# EAGLE design line-sensor-r2-linear (EAGLE 9.3.1)
Assembly variants: I2C, USART, SPI

## Sheet 1 of 4
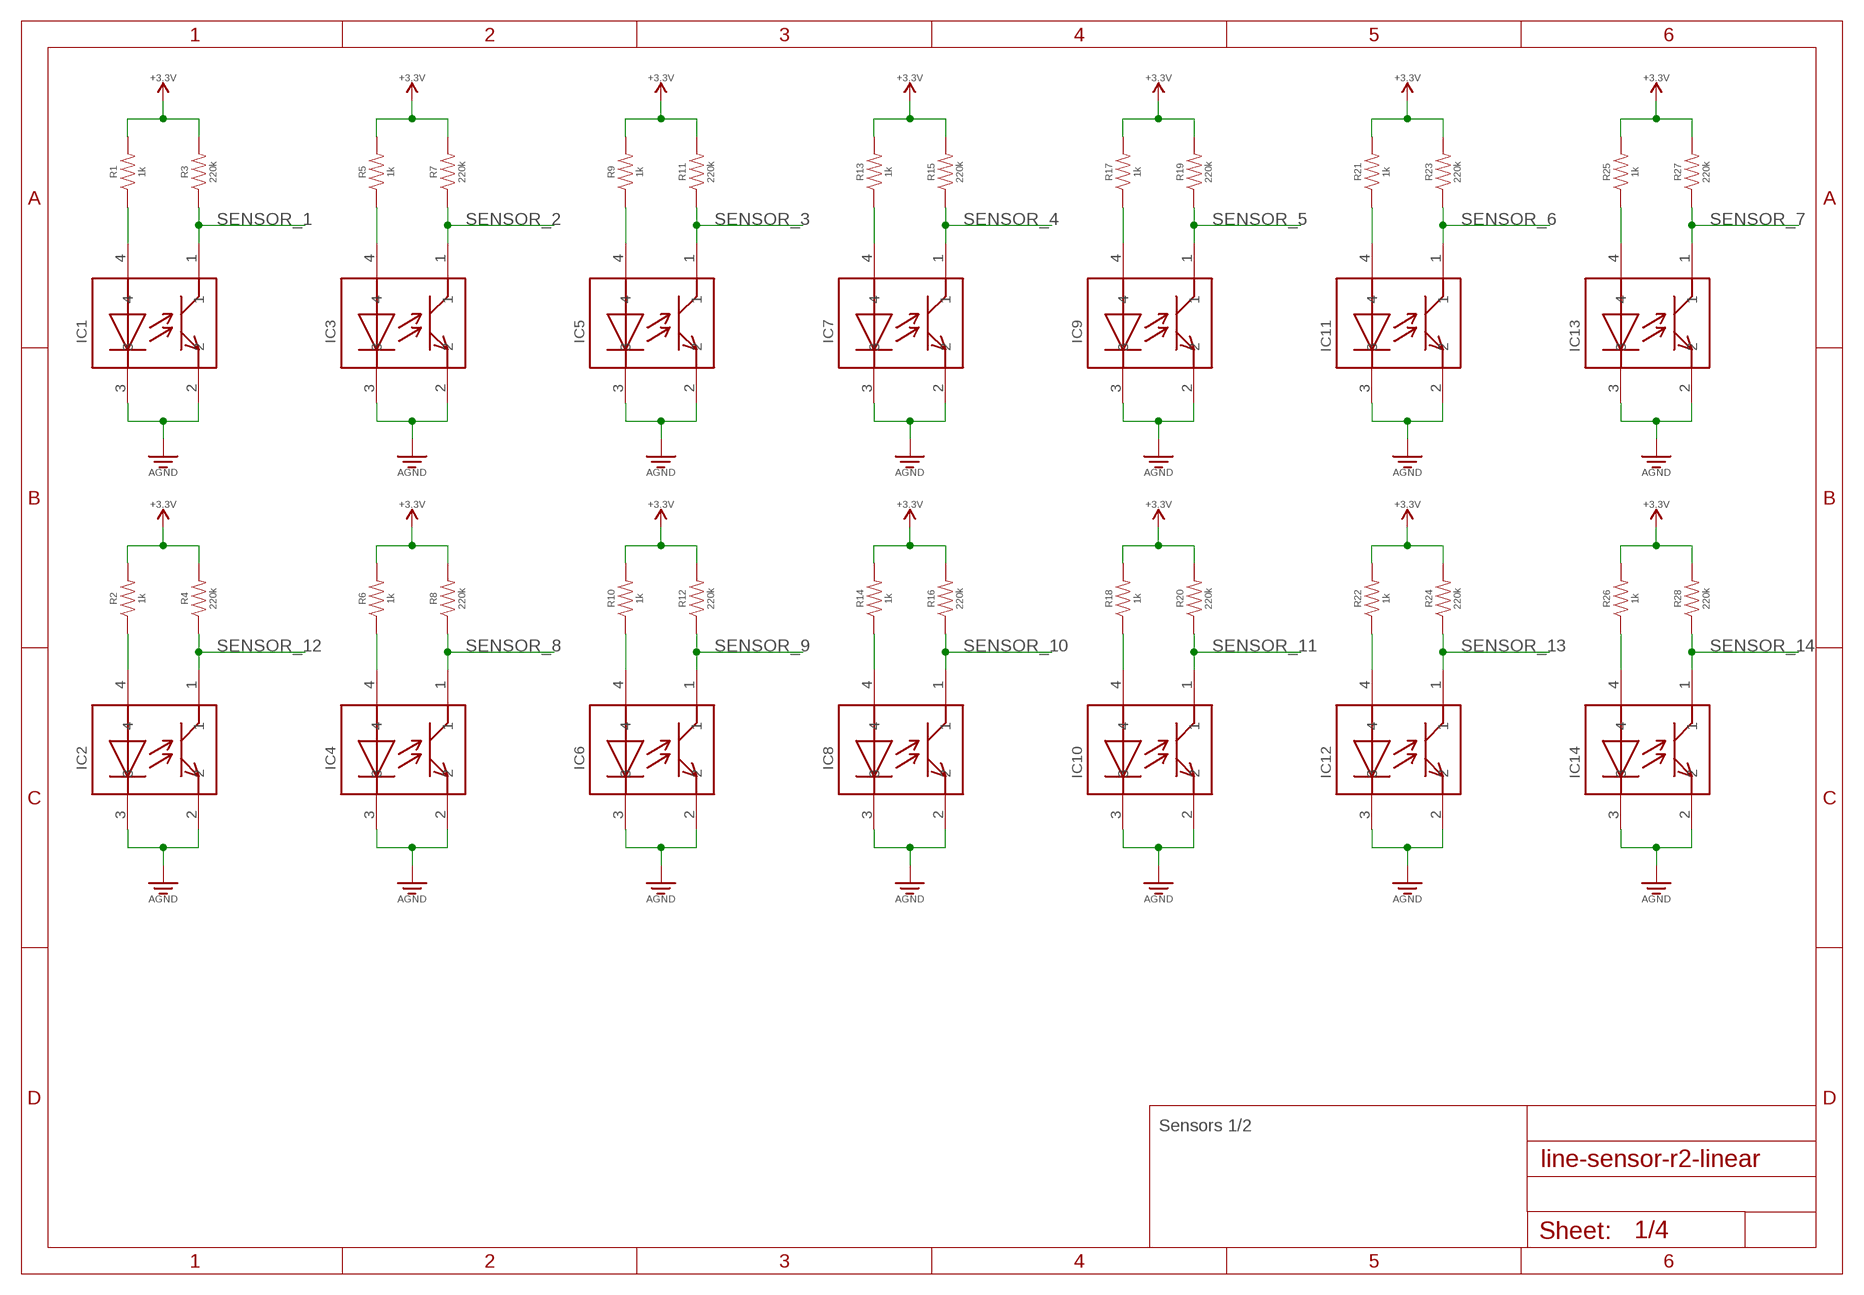
[diagram p0: schematic, sheet 1]

### Parts
IC1  GP2S60  [GP2S60]
IC2  GP2S60  [GP2S60]
IC3  GP2S60  [GP2S60]
IC4  GP2S60  [GP2S60]
IC5  GP2S60  [GP2S60]
IC6  GP2S60  [GP2S60]
IC7  GP2S60  [GP2S60]
IC8  GP2S60  [GP2S60]
IC9  GP2S60  [GP2S60]
IC10  GP2S60  [GP2S60]
IC11  GP2S60  [GP2S60]
IC12  GP2S60  [GP2S60]
IC13  GP2S60  [GP2S60]
IC14  GP2S60  [GP2S60]
R1  1k  RESISTOR_0.1W  [RESISTOR-0603]
R2  1k  RESISTOR_0.1W  [RESISTOR-0603]
R3  220k  RESISTOR_0.1W  [RESISTOR-0603]
R4  220k  RESISTOR_0.1W  [RESISTOR-0603]
R5  1k  RESISTOR_0.1W  [RESISTOR-0603]
R6  1k  RESISTOR_0.1W  [RESISTOR-0603]
R7  220k  RESISTOR_0.1W  [RESISTOR-0603]
R8  220k  RESISTOR_0.1W  [RESISTOR-0603]
R9  1k  RESISTOR_0.1W  [RESISTOR-0603]
R10  1k  RESISTOR_0.1W  [RESISTOR-0603]
R11  220k  RESISTOR_0.1W  [RESISTOR-0603]
R12  220k  RESISTOR_0.1W  [RESISTOR-0603]
R13  1k  RESISTOR_0.1W  [RESISTOR-0603]
R14  1k  RESISTOR_0.1W  [RESISTOR-0603]
R15  220k  RESISTOR_0.1W  [RESISTOR-0603]
R16  220k  RESISTOR_0.1W  [RESISTOR-0603]
R17  1k  RESISTOR_0.1W  [RESISTOR-0603]
R18  1k  RESISTOR_0.1W  [RESISTOR-0603]
R19  220k  RESISTOR_0.1W  [RESISTOR-0603]
R20  220k  RESISTOR_0.1W  [RESISTOR-0603]
R21  1k  RESISTOR_0.1W  [RESISTOR-0603]
R22  1k  RESISTOR_0.1W  [RESISTOR-0603]
R23  220k  RESISTOR_0.1W  [RESISTOR-0603]
R24  220k  RESISTOR_0.1W  [RESISTOR-0603]
R25  1k  RESISTOR_0.1W  [RESISTOR-0603]
R26  1k  RESISTOR_0.1W  [RESISTOR-0603]
R27  220k  RESISTOR_0.1W  [RESISTOR-0603]
R28  220k  RESISTOR_0.1W  [RESISTOR-0603]
SUPPLY1  +3.3V  (no package)
SUPPLY2  +3.3V  (no package)
SUPPLY3  +3.3V  (no package)
SUPPLY4  +3.3V  (no package)
SUPPLY5  +3.3V  (no package)
SUPPLY6  +3.3V  (no package)
SUPPLY7  +3.3V  (no package)
SUPPLY8  +3.3V  (no package)
SUPPLY9  +3.3V  (no package)
SUPPLY10  +3.3V  (no package)
SUPPLY11  +3.3V  (no package)
SUPPLY12  +3.3V  (no package)
SUPPLY13  +3.3V  (no package)
SUPPLY14  +3.3V  (no package)

### Nets
GND: IC1.2 IC1.3 IC2.2 IC2.3 IC3.2 IC3.3 IC4.2 IC4.3 IC5.2 IC5.3 IC6.2 IC6.3 IC7.2 IC7.3 IC8.2 IC8.3 IC9.2 IC9.3 IC10.2 IC10.3 IC11.2 IC11.3 IC12.2 IC12.3 IC13.2 IC13.3 IC14.2 IC14.3 ; supply symbol labelled AGND ; also sheet 2,3,4
N$1: IC3.4 R5.P$1
N$2: IC1.4 R1.P$1
N$3: IC5.4 R9.P$1
N$4: IC7.4 R13.P$1
N$5: IC9.4 R17.P$1
N$6: IC11.4 R21.P$1
N$7: IC13.4 R25.P$1
N$8: IC4.4 R6.P$1
N$9: IC6.4 R10.P$1
N$10: IC8.4 R14.P$1
N$11: IC10.4 R18.P$1
N$12: IC2.4 R2.P$1
N$13: IC12.4 R22.P$1
N$14: IC14.4 R26.P$1
SENSOR_1: IC1.1 R3.P$1 ; also sheet 3
SENSOR_2: IC3.1 R7.P$1 ; also sheet 3
SENSOR_3: IC5.1 R11.P$1 ; also sheet 3
SENSOR_4: IC7.1 R15.P$1 ; also sheet 3
SENSOR_5: IC9.1 R19.P$1 ; also sheet 3
SENSOR_6: IC11.1 R23.P$1 ; also sheet 3
SENSOR_7: IC13.1 R27.P$1 ; also sheet 3
SENSOR_8: IC4.1 R8.P$1 ; also sheet 3
SENSOR_9: IC6.1 R12.P$1 ; also sheet 3
SENSOR_10: IC8.1 R16.P$1 ; also sheet 3
SENSOR_11: IC10.1 R20.P$1 ; also sheet 3
SENSOR_12: IC2.1 R4.P$1 ; also sheet 3
SENSOR_13: IC12.1 R24.P$1 ; also sheet 3
SENSOR_14: IC14.1 R28.P$1 ; also sheet 3
VDDA: R1.P$2 R2.P$2 R3.P$2 R4.P$2 R5.P$2 R6.P$2 R7.P$2 R8.P$2 R9.P$2 R10.P$2 R11.P$2 R12.P$2 R13.P$2 R14.P$2 R15.P$2 R16.P$2 R17.P$2 R18.P$2 R19.P$2 R20.P$2 R21.P$2 R22.P$2 R23.P$2 R24.P$2 R25.P$2 R26.P$2 R27.P$2 R28.P$2 SUPPLY1.VCC SUPPLY2.VCC SUPPLY3.VCC SUPPLY4.VCC SUPPLY5.VCC SUPPLY6.VCC SUPPLY7.VCC SUPPLY8.VCC SUPPLY9.VCC SUPPLY10.VCC SUPPLY11.VCC SUPPLY12.VCC SUPPLY13.VCC SUPPLY14.VCC ; also sheet 2,3,4

### Notes on the sheet
- Sensors 1/2

## Sheet 2 of 4
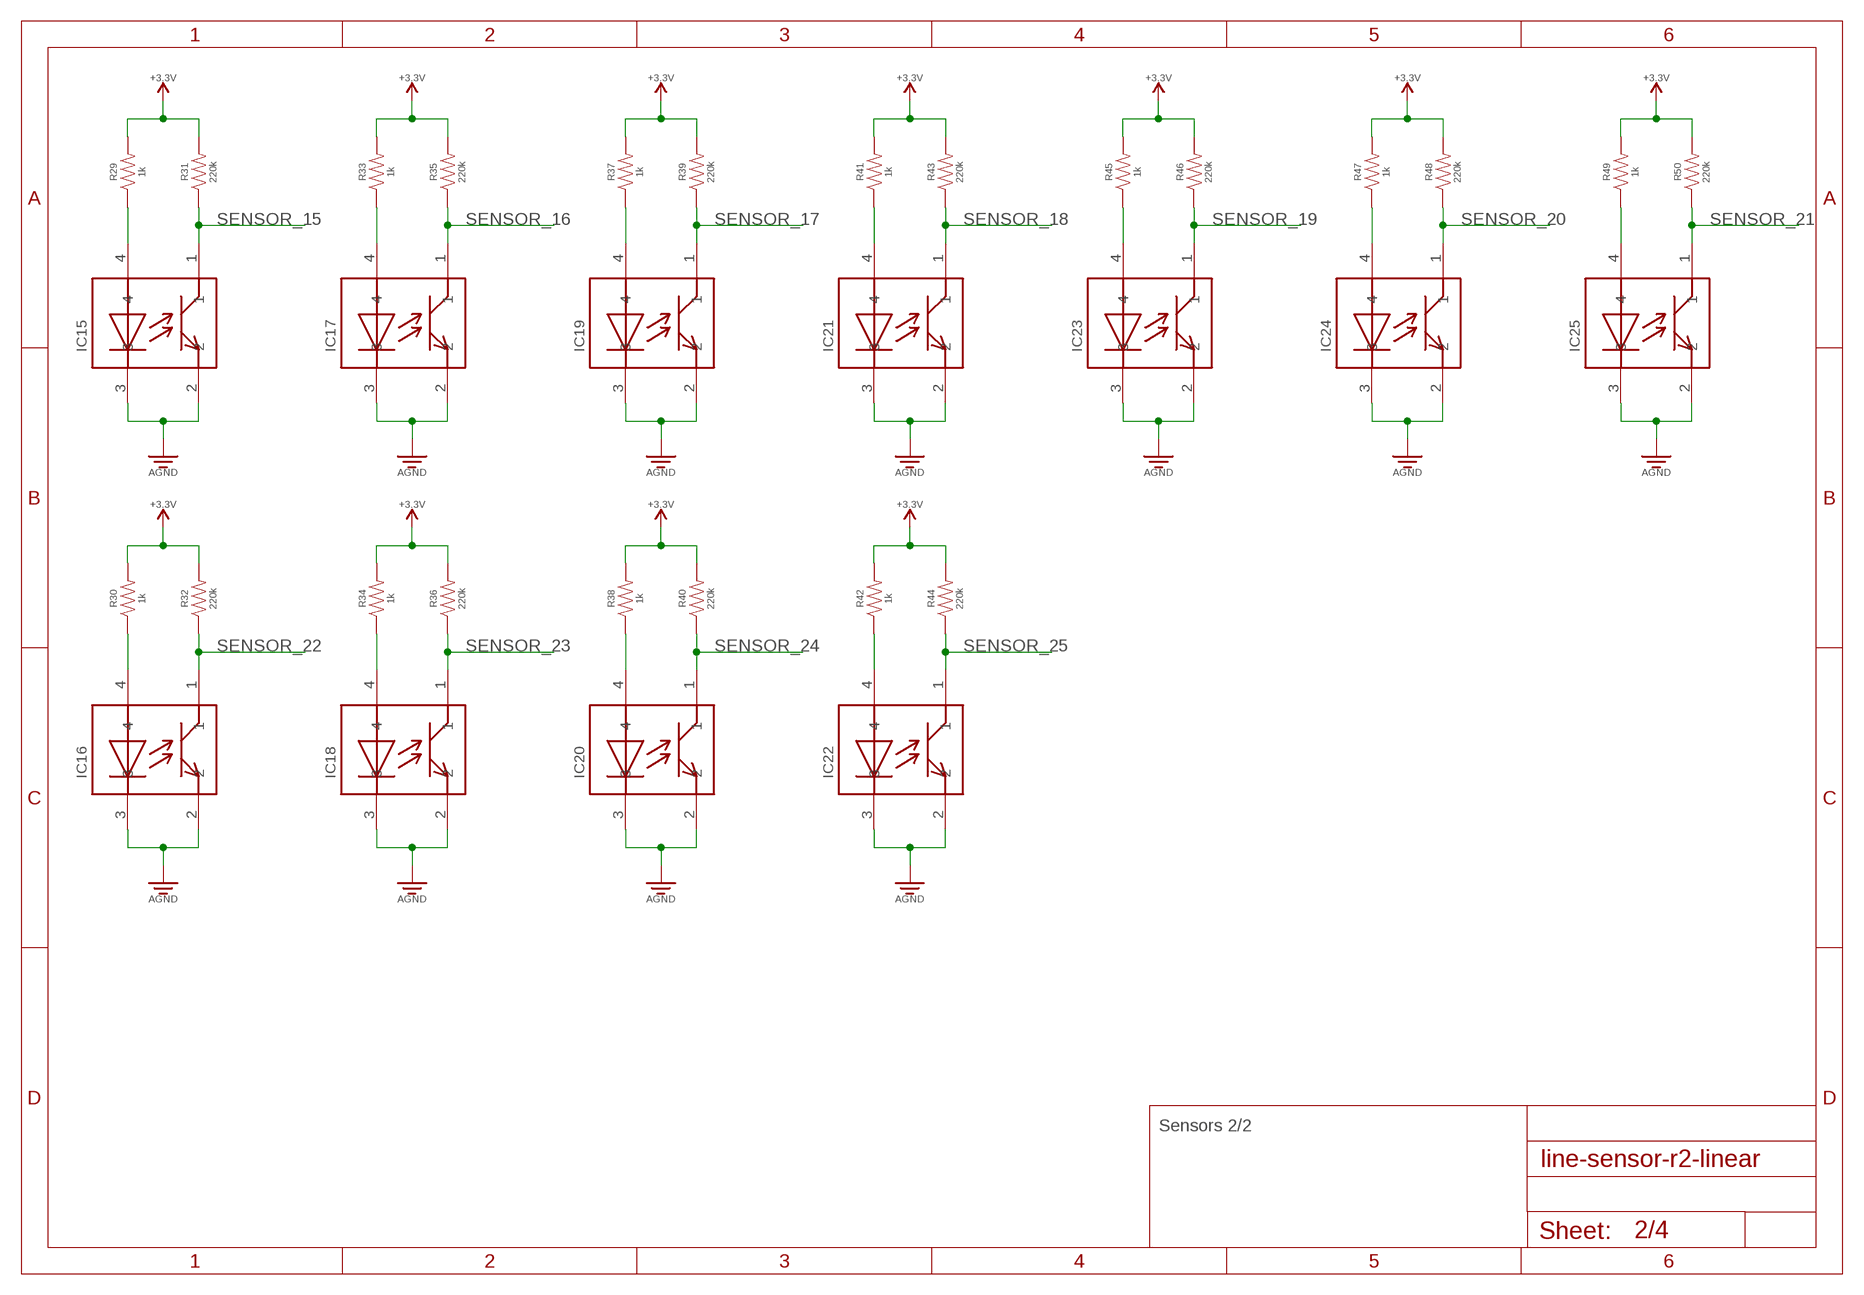
[diagram p1: schematic, sheet 2]

### Parts
IC15  GP2S60  [GP2S60]
IC16  GP2S60  [GP2S60]
IC17  GP2S60  [GP2S60]
IC18  GP2S60  [GP2S60]
IC19  GP2S60  [GP2S60]
IC20  GP2S60  [GP2S60]
IC21  GP2S60  [GP2S60]
IC22  GP2S60  [GP2S60]
IC23  GP2S60  [GP2S60]
IC24  GP2S60  [GP2S60]
IC25  GP2S60  [GP2S60]
R29  1k  RESISTOR_0.1W  [RESISTOR-0603]
R30  1k  RESISTOR_0.1W  [RESISTOR-0603]
R31  220k  RESISTOR_0.1W  [RESISTOR-0603]
R32  220k  RESISTOR_0.1W  [RESISTOR-0603]
R33  1k  RESISTOR_0.1W  [RESISTOR-0603]
R34  1k  RESISTOR_0.1W  [RESISTOR-0603]
R35  220k  RESISTOR_0.1W  [RESISTOR-0603]
R36  220k  RESISTOR_0.1W  [RESISTOR-0603]
R37  1k  RESISTOR_0.1W  [RESISTOR-0603]
R38  1k  RESISTOR_0.1W  [RESISTOR-0603]
R39  220k  RESISTOR_0.1W  [RESISTOR-0603]
R40  220k  RESISTOR_0.1W  [RESISTOR-0603]
R41  1k  RESISTOR_0.1W  [RESISTOR-0603]
R42  1k  RESISTOR_0.1W  [RESISTOR-0603]
R43  220k  RESISTOR_0.1W  [RESISTOR-0603]
R44  220k  RESISTOR_0.1W  [RESISTOR-0603]
R45  1k  RESISTOR_0.1W  [RESISTOR-0603]
R46  220k  RESISTOR_0.1W  [RESISTOR-0603]
R47  1k  RESISTOR_0.1W  [RESISTOR-0603]
R48  220k  RESISTOR_0.1W  [RESISTOR-0603]
R49  1k  RESISTOR_0.1W  [RESISTOR-0603]
R50  220k  RESISTOR_0.1W  [RESISTOR-0603]
SUPPLY15  +3.3V  (no package)
SUPPLY16  +3.3V  (no package)
SUPPLY17  +3.3V  (no package)
SUPPLY18  +3.3V  (no package)
SUPPLY19  +3.3V  (no package)
SUPPLY20  +3.3V  (no package)
SUPPLY21  +3.3V  (no package)
SUPPLY22  +3.3V  (no package)
SUPPLY23  +3.3V  (no package)
SUPPLY24  +3.3V  (no package)
SUPPLY25  +3.3V  (no package)

### Nets
GND: IC15.2 IC15.3 IC16.2 IC16.3 IC17.2 IC17.3 IC18.2 IC18.3 IC19.2 IC19.3 IC20.2 IC20.3 IC21.2 IC21.3 IC22.2 IC22.3 IC23.2 IC23.3 IC24.2 IC24.3 IC25.2 IC25.3 ; supply symbol labelled AGND ; also sheet 1,3,4
N$15: IC15.4 R29.P$1
N$16: IC17.4 R33.P$1
N$17: IC19.4 R37.P$1
N$18: IC21.4 R41.P$1
N$19: IC23.4 R45.P$1
N$20: IC24.4 R47.P$1
N$21: IC25.4 R49.P$1
N$22: IC16.4 R30.P$1
N$23: IC18.4 R34.P$1
N$24: IC20.4 R38.P$1
N$25: IC22.4 R42.P$1
SENSOR_15: IC15.1 R31.P$1 ; also sheet 3
SENSOR_16: IC17.1 R35.P$1 ; also sheet 3
SENSOR_17: IC19.1 R39.P$1 ; also sheet 3
SENSOR_18: IC21.1 R43.P$1 ; also sheet 3
SENSOR_19: IC23.1 R46.P$1 ; also sheet 3
SENSOR_20: IC24.1 R48.P$1 ; also sheet 3
SENSOR_21: IC25.1 R50.P$1 ; also sheet 3
SENSOR_22: IC16.1 R32.P$1 ; also sheet 3
SENSOR_23: IC18.1 R36.P$1 ; also sheet 3
SENSOR_24: IC20.1 R40.P$1 ; also sheet 3
SENSOR_25: IC22.1 R44.P$1 ; also sheet 3
VDDA: R29.P$2 R30.P$2 R31.P$2 R32.P$2 R33.P$2 R34.P$2 R35.P$2 R36.P$2 R37.P$2 R38.P$2 R39.P$2 R40.P$2 R41.P$2 R42.P$2 R43.P$2 R44.P$2 R45.P$2 R46.P$2 R47.P$2 R48.P$2 R49.P$2 R50.P$2 SUPPLY15.VCC SUPPLY16.VCC SUPPLY17.VCC SUPPLY18.VCC SUPPLY19.VCC SUPPLY20.VCC SUPPLY21.VCC SUPPLY22.VCC SUPPLY23.VCC SUPPLY24.VCC SUPPLY25.VCC ; also sheet 1,3,4

### Notes on the sheet
- Sensors 2/2

## Sheet 3 of 4
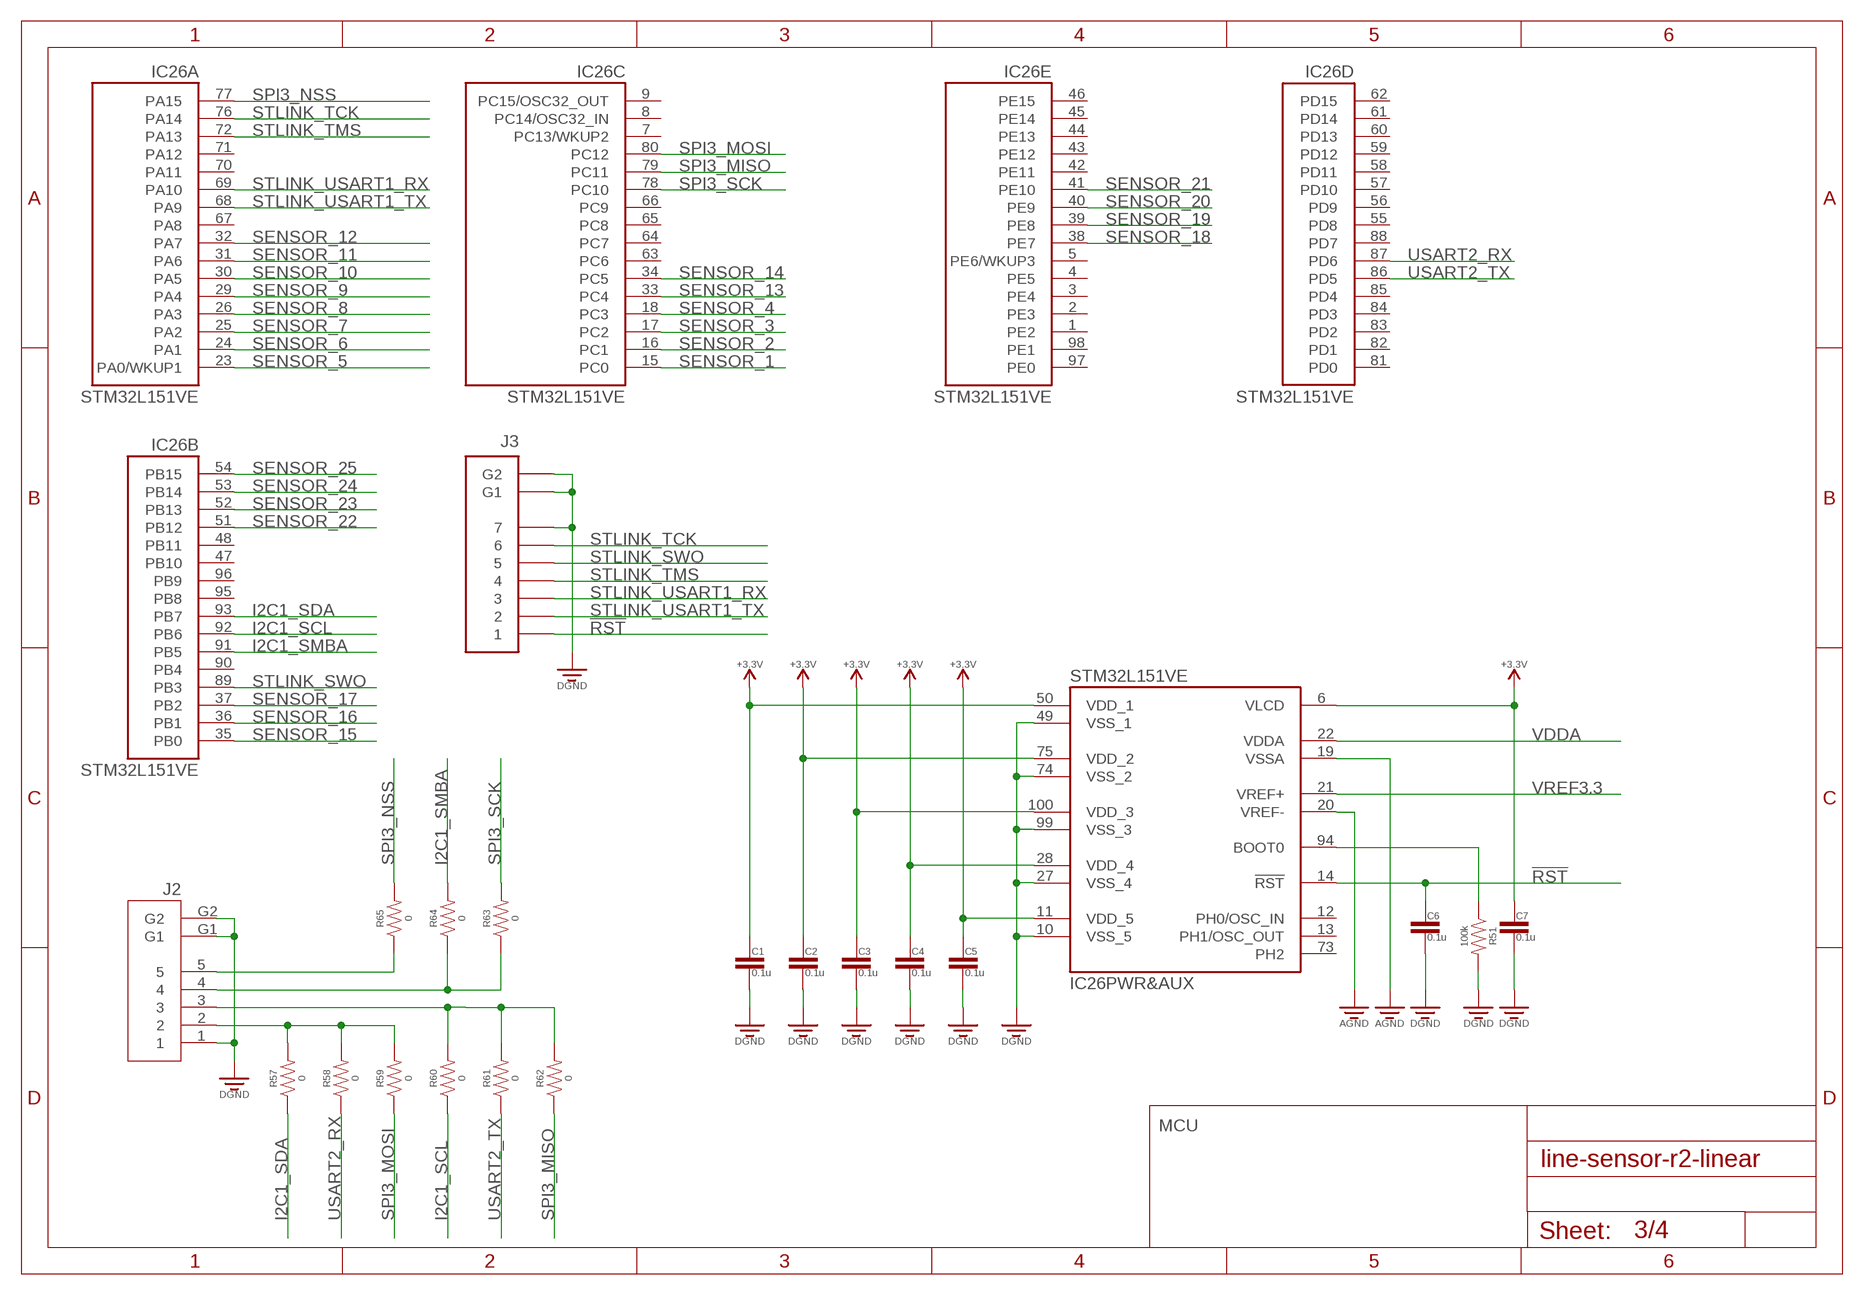
[diagram p2: schematic, sheet 3]

### Parts
C1  0.1u  CAPACITOR0603  [CAPACITOR-0603]
C2  0.1u  CAPACITOR0603  [CAPACITOR-0603]
C3  0.1u  CAPACITOR0603  [CAPACITOR-0603]
C4  0.1u  CAPACITOR0603  [CAPACITOR-0603]
C5  0.1u  CAPACITOR0603  [CAPACITOR-0603]
C6  0.1u  CAPACITOR0603  [CAPACITOR-0603]
C7  0.1u  CAPACITOR0603  [CAPACITOR-0603]
IC26  STM32L151VE  [LQFP100_14X14]
J2  MOLEX-502382-05XX  [MOLEX-502382-05XX]
J3  MOLEX-53261-0771  [MOLEX-53261-0771]
R51  100k  RESISTOR_0.1W  [RESISTOR-0603]
R57  0  RESISTOR_0.1W  [RESISTOR-0603]  (not fitted in variant USART)  (not fitted in variant SPI)
R58  0  RESISTOR_0.1W  [RESISTOR-0603]  (not fitted in variant I2C)  (not fitted in variant SPI)
R59  0  RESISTOR_0.1W  [RESISTOR-0603]  (not fitted in variant I2C)  (not fitted in variant USART)
R60  0  RESISTOR_0.1W  [RESISTOR-0603]  (not fitted in variant USART)  (not fitted in variant SPI)
R61  0  RESISTOR_0.1W  [RESISTOR-0603]  (not fitted in variant I2C)  (not fitted in variant SPI)
R62  0  RESISTOR_0.1W  [RESISTOR-0603]  (not fitted in variant I2C)  (not fitted in variant USART)
R63  0  RESISTOR_0.1W  [RESISTOR-0603]  (not fitted in variant I2C)  (not fitted in variant USART)
R64  0  RESISTOR_0.1W  [RESISTOR-0603]  (not fitted in variant USART)  (not fitted in variant SPI)
R65  0  RESISTOR_0.1W  [RESISTOR-0603]  (not fitted in variant I2C)  (not fitted in variant USART)
SUPPLY26  +3.3V  (no package)
SUPPLY27  +3.3V  (no package)
SUPPLY28  +3.3V  (no package)
SUPPLY29  +3.3V  (no package)
SUPPLY30  +3.3V  (no package)
SUPPLY31  +3.3V  (no package)

### Nets
!RST: C6.1 IC26.14(PWR&AUX:!RST!) J3.1
BOOT0: IC26.94(PWR&AUX:BOOT0) R51.P$1
GND: C1.2 C2.2 C3.2 C4.2 C5.2 C6.2 C7.2 IC26.10(PWR&AUX:VSS_5) IC26.19(PWR&AUX:VSSA) IC26.20(PWR&AUX:VREF-) IC26.27(PWR&AUX:VSS_4) IC26.49(PWR&AUX:VSS_1) IC26.74(PWR&AUX:VSS_2) IC26.99(PWR&AUX:VSS_3) J2.1 J2.G1 J2.G2 J3.7 J3.G1 J3.G2 R51.P$2 ; supply symbol labelled DGND, AGND ; also sheet 1,2,4
I2C1_SCL: IC26.92(B:PB6) R60.P$1
I2C1_SDA: IC26.93(B:PB7) R57.P$1
I2C1_SMBA: IC26.91(B:PB5) R64.P$2
N$26: J2.2 R57.P$2 R58.P$2 R59.P$2
N$27: J2.3 R60.P$2 R61.P$2 R62.P$2
N$28: J2.4 R63.P$1 R64.P$1
N$29: J2.5 R65.P$1
SENSOR_1: IC26.15(C:PC0) ; also sheet 1
SENSOR_2: IC26.16(C:PC1) ; also sheet 1
SENSOR_3: IC26.17(C:PC2) ; also sheet 1
SENSOR_4: IC26.18(C:PC3) ; also sheet 1
SENSOR_5: IC26.23(A:PA0/WKUP1) ; also sheet 1
SENSOR_6: IC26.24(A:PA1) ; also sheet 1
SENSOR_7: IC26.25(A:PA2) ; also sheet 1
SENSOR_8: IC26.26(A:PA3) ; also sheet 1
SENSOR_9: IC26.29(A:PA4) ; also sheet 1
SENSOR_10: IC26.30(A:PA5) ; also sheet 1
SENSOR_11: IC26.31(A:PA6) ; also sheet 1
SENSOR_12: IC26.32(A:PA7) ; also sheet 1
SENSOR_13: IC26.33(C:PC4) ; also sheet 1
SENSOR_14: IC26.34(C:PC5) ; also sheet 1
SENSOR_15: IC26.35(B:PB0) ; also sheet 2
SENSOR_16: IC26.36(B:PB1) ; also sheet 2
SENSOR_17: IC26.37(B:PB2) ; also sheet 2
SENSOR_18: IC26.38(E:PE7) ; also sheet 2
SENSOR_19: IC26.39(E:PE8) ; also sheet 2
SENSOR_20: IC26.40(E:PE9) ; also sheet 2
SENSOR_21: IC26.41(E:PE10) ; also sheet 2
SENSOR_22: IC26.51(B:PB12) ; also sheet 2
SENSOR_23: IC26.52(B:PB13) ; also sheet 2
SENSOR_24: IC26.53(B:PB14) ; also sheet 2
SENSOR_25: IC26.54(B:PB15) ; also sheet 2
SPI3_MISO: IC26.79(C:PC11) R62.P$1
SPI3_MOSI: IC26.80(C:PC12) R59.P$1
SPI3_NSS: IC26.77(A:PA15) R65.P$2
SPI3_SCK: IC26.78(C:PC10) R63.P$2
STLINK_SWO: IC26.89(B:PB3) J3.5
STLINK_TCK: IC26.76(A:PA14) J3.6
STLINK_TMS: IC26.72(A:PA13) J3.4
STLINK_USART1_RX: IC26.69(A:PA10) J3.3
STLINK_USART1_TX: IC26.68(A:PA9) J3.2
USART2_RX: IC26.87(D:PD6) R58.P$1
USART2_TX: IC26.86(D:PD5) R61.P$1
VDD: C1.1 C2.1 C3.1 C4.1 C5.1 C7.1 IC26.6(PWR&AUX:VLCD) IC26.11(PWR&AUX:VDD_5) IC26.28(PWR&AUX:VDD_4) IC26.50(PWR&AUX:VDD_1) IC26.75(PWR&AUX:VDD_2) IC26.100(PWR&AUX:VDD_3) SUPPLY26.VCC SUPPLY27.VCC SUPPLY28.VCC SUPPLY29.VCC SUPPLY30.VCC SUPPLY31.VCC ; also sheet 4
VDDA: IC26.22(PWR&AUX:VDDA) ; also sheet 1,2,4
VREF3.3: IC26.21(PWR&AUX:VREF+) ; also sheet 4
Unconnected: IC26.1(E:PE2) IC26.2(E:PE3) IC26.3(E:PE4) IC26.4(E:PE5) IC26.5(E:PE6/WKUP3) IC26.7(C:PC13/WKUP2) IC26.8(C:PC14/OSC32_IN) IC26.9(C:PC15/OSC32_OUT) IC26.12(PWR&AUX:PH0/OSC_IN) IC26.13(PWR&AUX:PH1/OSC_OUT) IC26.42(E:PE11) IC26.43(E:PE12) IC26.44(E:PE13) IC26.45(E:PE14) IC26.46(E:PE15) IC26.47(B:PB10) IC26.48(B:PB11) IC26.55(D:PD8) IC26.56(D:PD9) IC26.57(D:PD10) IC26.58(D:PD11) IC26.59(D:PD12) IC26.60(D:PD13) IC26.61(D:PD14) IC26.62(D:PD15) IC26.63(C:PC6) IC26.64(C:PC7) IC26.65(C:PC8) IC26.66(C:PC9) IC26.67(A:PA8) IC26.70(A:PA11) IC26.71(A:PA12) IC26.73(PWR&AUX:PH2) IC26.81(D:PD0) IC26.82(D:PD1) IC26.83(D:PD2) IC26.84(D:PD3) IC26.85(D:PD4) IC26.88(D:PD7) IC26.90(B:PB4) IC26.95(B:PB8) IC26.96(B:PB9) IC26.97(E:PE0) IC26.98(E:PE1)

### Notes on the sheet
- MCU

## Sheet 4 of 4
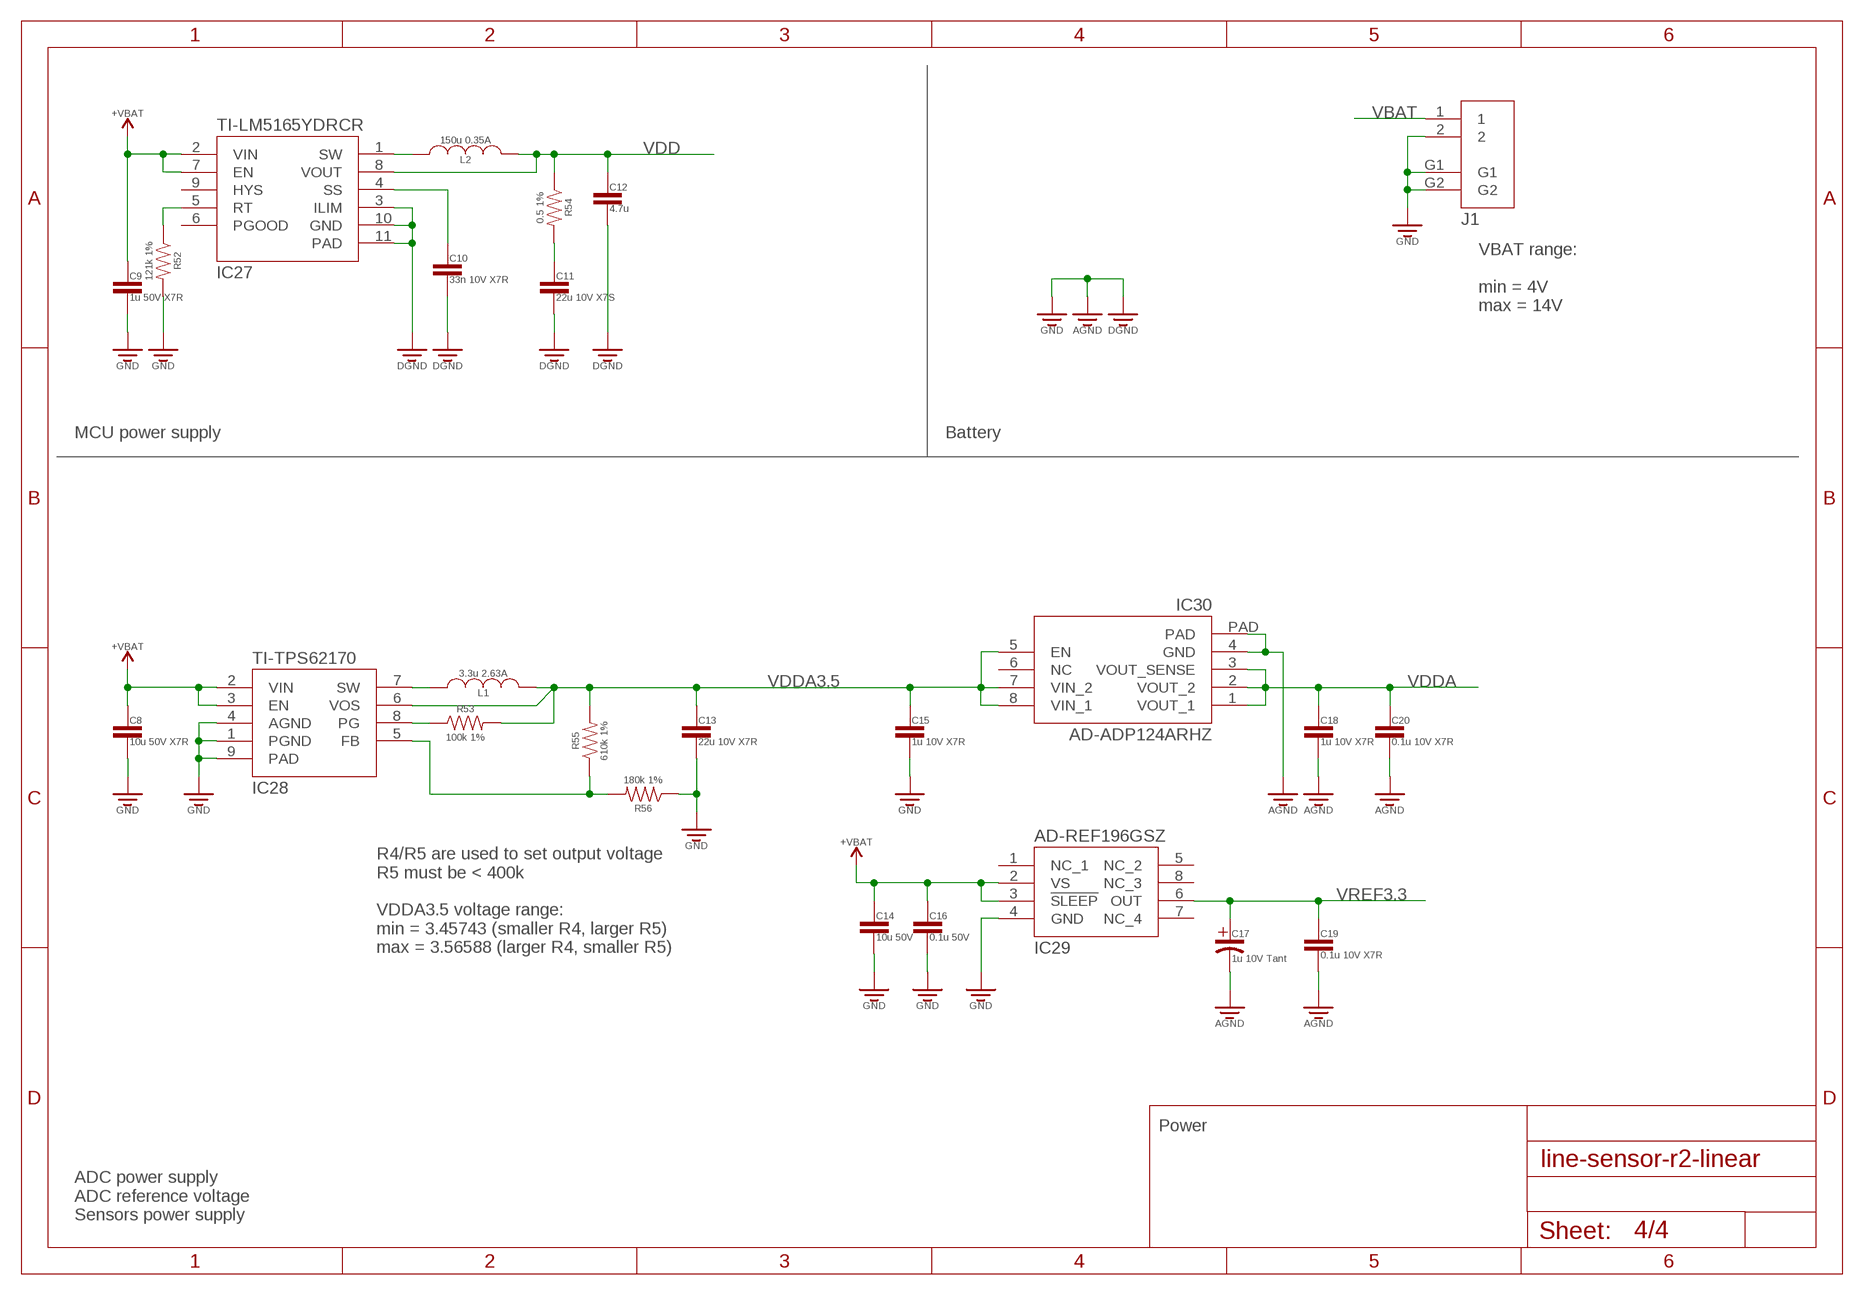
[diagram p3: schematic, sheet 4]

### Parts
C8  10u 50V X7R  CAPACITOR0805  [CAPACITOR-0805]
C9  1u 50V X7R  CAPACITOR1206  [CAPACITOR-1206]
C10  33n 10V X7R  CAPACITOR0603  [CAPACITOR-0603]
C11  22u 10V X7S  CAPACITOR0805  [CAPACITOR-0805]
C12  4.7u  CAPACITOR0805  [CAPACITOR-0805]
C13  22u 10V X7R  CAPACITOR0805  [CAPACITOR-0805]
C14  10u 50V  CAPACITOR0603  [CAPACITOR-0603]
C15  1u 10V X7R  CAPACITOR0805  [CAPACITOR-0805]
C16  0.1u 50V  CAPACITOR0603  [CAPACITOR-0603]
C17  1u 10V Tant  CAPACITOR_POLARIZED  [CAPACITOR_POLARIZED-1411-(3528-MET)]
C18  1u 10V X7R  CAPACITOR0805  [CAPACITOR-0805]
C19  0.1u 10V X7R  CAPACITOR0603  [CAPACITOR-0603]
C20  0.1u 10V X7R  CAPACITOR0603  [CAPACITOR-0603]
IC27  TI-LM5165YDRCR  [VSON-10-0.5MM]
IC28  TI-TPS62170  [WSON-8-0.5MM]
IC29  AD-REF196GSZ  [SOIC-8]
IC30  AD-ADP124ARHZ  [MSOP-8-EP]
J1  MOLEX-502382-02XX  [MOLEX-502382-02XX]
L1  3.3u 2.63A  VLS3012HBX  [VLS3012HBX]
L2  150u 0.35A  ELL-6SH151M  [ELL-6SH151M]
R52  121k 1%  RESISTOR_0.1W  [RESISTOR-0603]
R53  100k 1%  RESISTOR_0.1W  [RESISTOR-0603]
R54  0.5 1%  RESISTOR_0.1W  [RESISTOR-0603]
R55  610k 1%  RESISTOR_0.1W  [RESISTOR-0603]
R56  180k 1%  RESISTOR_0.1W  [RESISTOR-0603]
SUPPLY32  +VBAT  (no package)
SUPPLY33  +VBAT  (no package)
SUPPLY34  +VBAT  (no package)

### Nets
GND: C8.2 C9.P$2 C10.2 C11.2 C12.2 C13.2 C14.2 C15.2 C16.2 C17.NEG C18.2 C19.2 C20.2 IC27.3(ILIM) IC27.10(GND) IC27.11(PAD) IC28.1(PGND) IC28.4(AGND) IC28.9(PAD) IC29.4(GND) IC30.4(GND) IC30.PAD J1.2 J1.G1 J1.G2 R52.P$2 R56.P$1 ; supply symbol labelled DGND, AGND ; also sheet 1,2,3
IC27_SW: IC27.1(SW) L2.1
IC28_SW: IC28.7(SW) L1.1
N$33: IC27.5(RT) R52.P$1
N$34: C10.1 IC27.4(SS)
N$36: C11.1 R54.P$2
N$38: IC28.8(PG) R53.P$1
N$39: IC28.5(FB) R55.P$1 R56.P$2
VBAT: C8.1 C9.P$1 C14.1 C16.1 IC27.2(VIN) IC27.7(EN) IC28.2(VIN) IC28.3(EN) IC29.2(VS) IC29.3(!SLEEP) J1.1 SUPPLY32.VCC SUPPLY33.VCC SUPPLY34.VCC
VDD: C12.1 IC27.8(VOUT) L2.2 R54.P$1 ; also sheet 3
VDDA: C18.1 C20.1 IC30.1(VOUT_1) IC30.2(VOUT_2) IC30.3(VOUT_SENSE) ; also sheet 1,2,3
VDDA3.5: C13.1 C15.1 IC28.6(VOS) IC30.5(EN) IC30.7(VIN_2) IC30.8(VIN_1) L1.2 R53.P$2 R55.P$2
VREF3.3: C17.POS C19.1 IC29.6(OUT) ; also sheet 3
Unconnected: IC27.6(PGOOD) IC27.9(HYS) IC29.1(NC_1) IC29.5(NC_2) IC29.7(NC_4) IC29.8(NC_3) IC30.6(NC)

### Notes on the sheet
- VBAT range:
  
  min = 4V
  max = 14V
- MCU power supply | Battery
- R4/R5 are used to set output voltage
  R5 must be < 400k
  
  VDDA3.5 voltage range:
  min = 3.45743 (smaller R4, larger R5)
  max = 3.56588 (larger R4, smaller R5)
- Power
- ADC power supply
  ADC reference voltage
  Sensors power supply

## Library data of the parts
C1-C16 C18-C20 = capacitors:CAPACITOR
C17 = capacitors:CAPACITOR_POLARIZED
IC1-IC25 = sensors:GP2S60: SMT Compact Reﬂective Photointerrupter Datasheet: http://www.sharp-world.com/products/device/lineup/data/pdf/datasheet/gp2s60_e.pdf
IC26 = mcu:STM32L151VE
IC27 = voltage-source:TI-LM5165YDRCR
IC28 = voltage-source:TI-TPS62170
IC29 = voltage-source:AD-REF196GSZ
IC30 = voltage-source:AD-ADP124ARHZ
J1 = connectors:MOLEX-502382-02XX
J2 = connectors:MOLEX-502382-05XX
J3 = connectors:MOLEX-53261-0771
L1 = inductors:VLS3012HBX
L2 = inductors:ELL-6SH151M
R1-R65 = resistors:RESISTOR_0.1W
SUPPLY1-SUPPLY31 = voltage-ground:+3.3V: +3.3V Voltage Supply Positive voltage supply (traditionally for a BJT device, C=collector).
SUPPLY32-SUPPLY34 = voltage-ground:+VBAT: +3.3V Voltage Supply Positive voltage supply (traditionally for a BJT device, C=collector).

## Net classes
1 ground: width 0.3 mm
2 3v3: width 0.3 mm

## Board
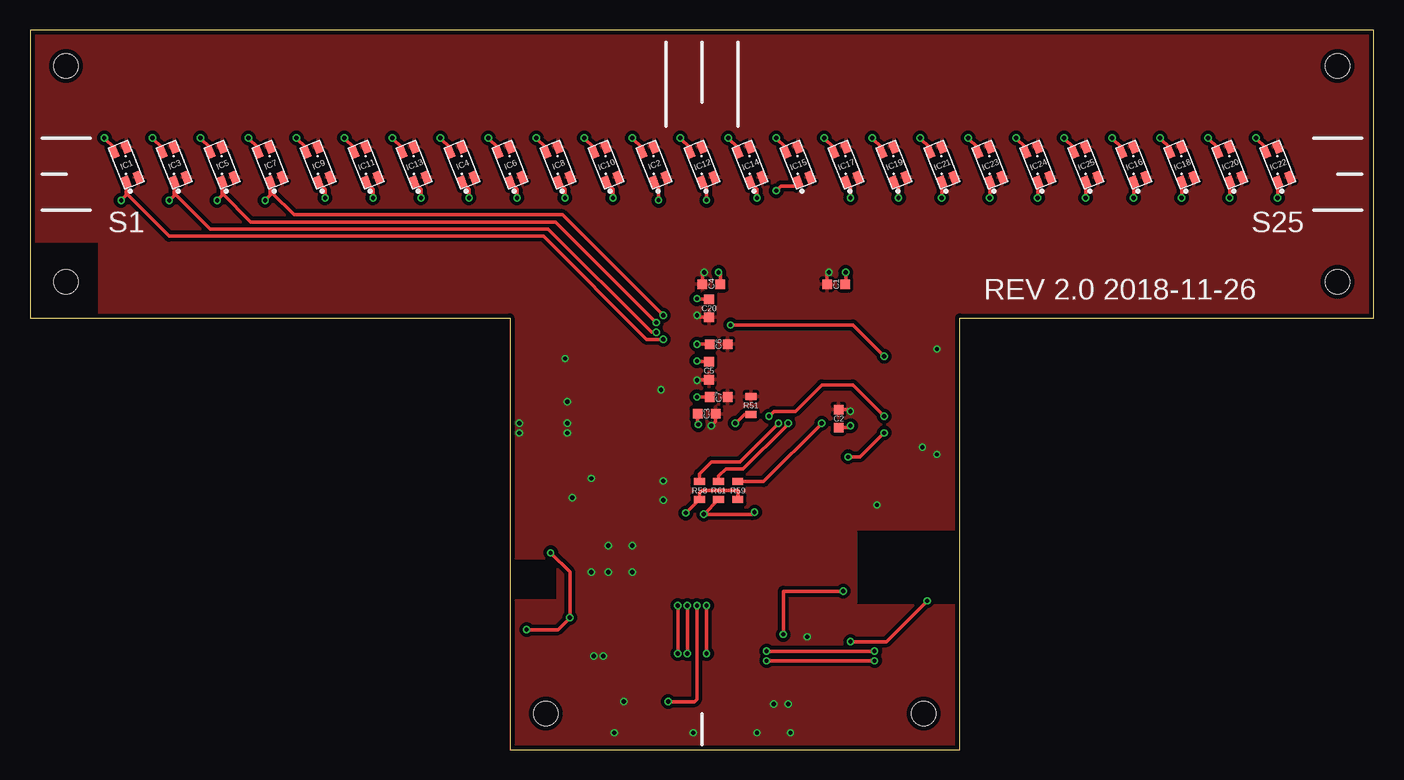
[diagram p4: board, top side]
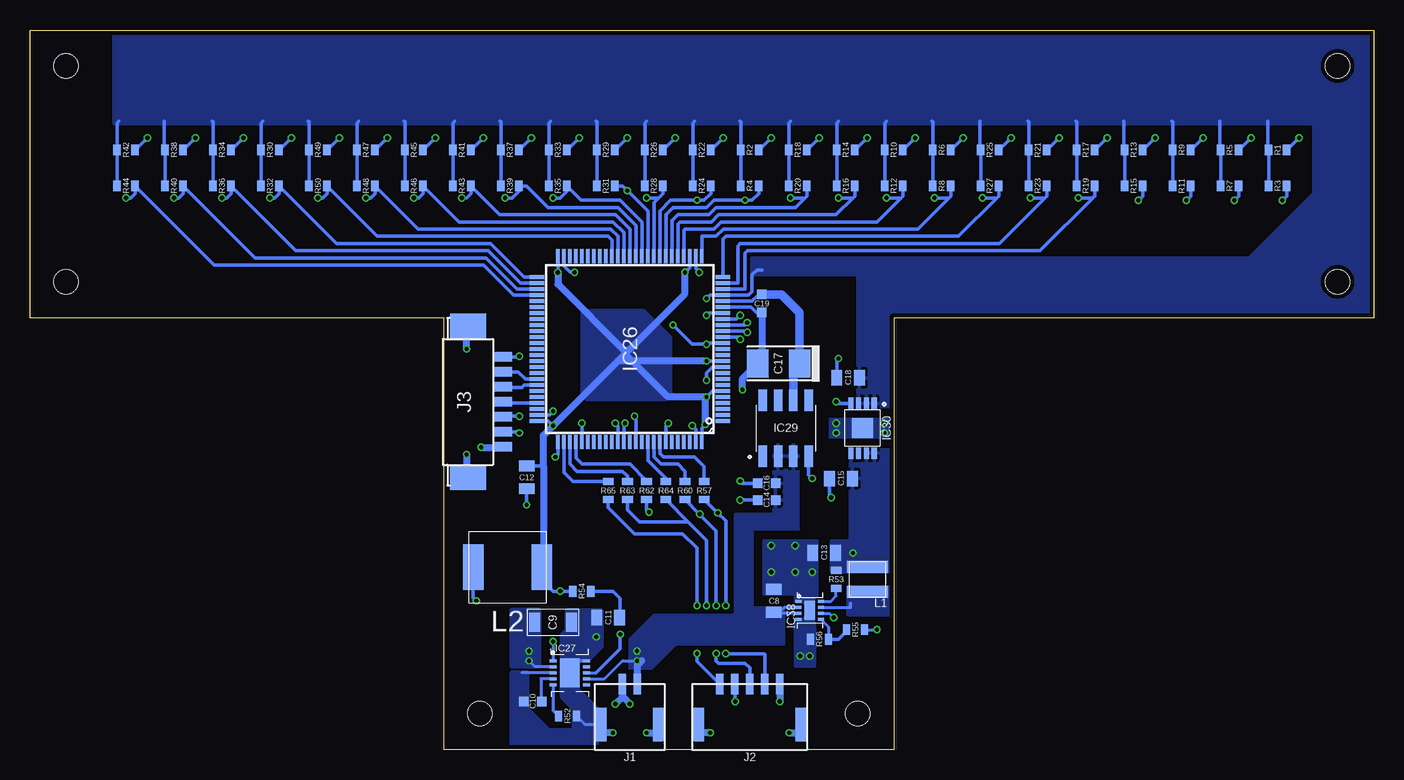
[diagram p5: board, bottom side, seen from below]

Size 112 x 60 mm. Coordinates in mm from the lower left corner, seen from the top.
Outline: 0,36 40,36 40,0 77.5,0 77.5,36 112,36 112,60 0,60 0,36
Copper layers (1*16): Top 0.035559375mm / dielectric 1.6mm / Bottom 0.035559375mm
Design rules "oshpark-2layer": minimum track width 6mil, minimum drill 10mil, track to track 6mil, track to pad 6mil, pad to pad 6mil, via to via 6mil, smd to smd 6mil, copper to edge 15mil, drill to drill 6mil, minimum pad ring 5mil, minimum via ring 5mil, stop-mask expansion 2.5mil, vias tented up to drill 0mil, thermal gap 10mil
Holes 2 mm at 3,57 3,39 109,57 109,39 43,3 74.5,3

### Footprints (pad centres in the part's own frame; a part is rotated, then mirrored left to right if it is on the bottom)
CAPACITOR-0603 = smd 0.8 x 0.8: 1 -0.75,0; 2 0.75,0
CAPACITOR-0805 = smd 0.9 x 1.3: 1 -0.95,0; 2 0.95,0
CAPACITOR-1206 = smd 0.9 x 1.6: P$1 -1.55,0; P$2 1.55,0
CAPACITOR_POLARIZED-1411-(3528-MET) = smd 1.8 x 2.35: NEG 1.75,0; POS -1.75,0
GP2S60 = smd 1 x 0.65: 1 -0.65,0.25; 2 -0.65,-0.85; 3 2.05,-0.85; 4 2.05,0.25
LQFP100_14X14 = smd 0.3 x 1.2: 1 -6,-7.75; 2 -5.5,-7.75; 3 -5,-7.75; 4 -4.5,-7.75; 5 -4,-7.75; 6 -3.5,-7.75; 7 -3,-7.75; 8 -2.5,-7.75; 9 -2,-7.75; 10 -1.5,-7.75; 11 -1,-7.75; 12 -0.5,-7.75; 13 0,-7.75; 14 0.5,-7.75; 15 1,-7.75; 16 1.5,-7.75; 17 2,-7.75; 18 2.5,-7.75; 19 3,-7.75; 20 3.5,-7.75; 21 4,-7.75; 22 4.5,-7.75; 23 5,-7.75; 24 5.5,-7.75; 25 6,-7.75; 51 6,7.75; 52 5.5,7.75; 53 5,7.75; 54 4.5,7.75; 55 4,7.75; 56 3.5,7.75; 57 3,7.75; 58 2.5,7.75; 59 2,7.75; 60 1.5,7.75; 61 1,7.75; 62 0.5,7.75; 63 0,7.75; 64 -0.5,7.75; 65 -1,7.75; 66 -1.5,7.75; 67 -2,7.75; 68 -2.5,7.75; 69 -3,7.75; 70 -3.5,7.75; 71 -4,7.75; 72 -4.5,7.75; 73 -5,7.75; 74 -5.5,7.75; 75 -6,7.75 | smd 1.2 x 0.3: 26 7.75,-6; 27 7.75,-5.5; 28 7.75,-5; 29 7.75,-4.5; 30 7.75,-4; 31 7.75,-3.5; 32 7.75,-3; 33 7.75,-2.5; 34 7.75,-2; 35 7.75,-1.5; 36 7.75,-1; 37 7.75,-0.5; 38 7.75,0; 39 7.75,0.5; 40 7.75,1; 41 7.75,1.5; 42 7.75,2; 43 7.75,2.5; 44 7.75,3; 45 7.75,3.5; 46 7.75,4; 47 7.75,4.5; 48 7.75,5; 49 7.75,5.5; 50 7.75,6; 76 -7.75,6; 77 -7.75,5.5; 78 -7.75,5; 79 -7.75,4.5; 80 -7.75,4; 81 -7.75,3.5; 82 -7.75,3; 83 -7.75,2.5; 84 -7.75,2; 85 -7.75,1.5; 86 -7.75,1; 87 -7.75,0.5; 88 -7.75,0; 89 -7.75,-0.5; 90 -7.75,-1; 91 -7.75,-1.5; 92 -7.75,-2; 93 -7.75,-2.5; 94 -7.75,-3; 95 -7.75,-3.5; 96 -7.75,-4; 97 -7.75,-4.5; 98 -7.75,-5; 99 -7.75,-5.5; 100 -7.75,-6
VSON-10-0.5MM = smd 0.6 x 0.24: 1 -1.4,1; 2 -1.4,0.5; 3 -1.4,0; 4 -1.4,-0.5; 5 -1.4,-1; 6 1.4,-1; 7 1.4,-0.5; 8 1.4,0; 9 1.4,0.5; 10 1.4,1 | smd 1.65 x 2.4: 11 0,0
WSON-8-0.5MM = smd 0.5 x 0.25: 1 -0.95,0.75; 2 -0.95,0.25; 3 -0.95,-0.25; 4 -0.95,-0.75; 5 0.95,-0.75; 6 0.95,-0.25; 7 0.95,0.25; 8 0.95,0.75 | smd 0.9 x 1.6: 9 0,0
SOIC-8 = smd 1.78 x 0.72: 1 -2.34,1.905; 2 -2.34,0.635; 3 -2.34,-0.635; 4 -2.34,-1.905; 5 2.34,-1.905; 6 2.34,-0.635; 7 2.34,0.635; 8 2.34,1.905
MSOP-8-EP = smd 0.95 x 0.42: 1 -2.075,0.975; 2 -2.075,0.325; 3 -2.075,-0.325; 4 -2.075,-0.975; 5 2.075,-0.975; 6 2.075,-0.325; 7 2.075,0.325; 8 2.075,0.975 | smd 1.66 x 1.725: PAD 0,0
MOLEX-502382-02XX = smd 0.6 x 1.7: 1 -0.625,-5.45; 2 0.625,-5.45 | smd 1 x 2.8: G1 -2.425,-2.1; G2 2.425,-2.1
MOLEX-502382-05XX = smd 0.6 x 1.7: 1 -2.5,-5.45; 2 -1.25,-5.45; 3 0,-5.45; 4 1.25,-5.45; 5 2.5,-5.45 | smd 1 x 2.8: G1 -4.3,-2.1; G2 4.3,-2.1
MOLEX-53261-0771 = smd 0.8 x 1.6: 1 -3.75,-0.8; 2 -2.5,-0.8; 3 -1.25,-0.8; 4 0,-0.8; 5 1.25,-0.8; 6 2.5,-0.8; 7 3.75,-0.8 | smd 2.1 x 3: G1 -6.3,-3.7; G2 6.3,-3.7
VLS3012HBX = smd 1 x 3.4: 1 -1.05,0; 2 1.05,0
ELL-6SH151M = smd 1.7 x 3.8: 1 -2.85,0; 2 2.85,0
RESISTOR-0603 = smd 0.6 x 0.9: P$1 -0.75,0; P$2 0.75,0

### Placement (x,y rotation side)
C1  67.2,38.8 180 top
C2  67.4,27.6 90 top
C3  56.4,28 0 top
C4  56.8,38.8 180 top
C5  56.6,31.6 270 top
C6  57.4,33.8 0 top
C7  57.4,29.4 0 top
C8  50,12.4 90 bottom
C9  68.4,10.6 0 bottom
C10  70.1,4 180 bottom
C11  63.8,11 180 bottom
C12  70.6,22.7 270 bottom
C13  45.8,16.4 180 bottom
C14  50.6,20.8 180 bottom
C15  44.4,22.6 180 bottom
C16  50.6,22.2 180 bottom
C17  49.6,32.2 180 bottom
C18  43.8,31 180 bottom
C19  51,37.2 270 bottom
C20  56.6,36.8 270 top
IC1  8,48 111.8 top
IC2  52,48 111.8 top
IC3  12,48 111.8 top
IC4  36,48 111.8 top
IC5  16,48 111.8 top
IC6  40,48 111.8 top
IC7  20,48 111.8 top
IC8  44,48 111.8 top
IC9  24,48 111.8 top
IC10  48,48 111.8 top
IC11  28,48 111.8 top
IC12  56,48 111.8 top
IC13  32,48 111.8 top
IC14  60,48 111.8 top
IC15  64,48 111.8 top
IC16  92,48 111.8 top
IC17  68,48 111.8 top
IC18  96,48 111.8 top
IC19  72,48 111.8 top
IC20  100,48 111.8 top
IC21  76,48 111.8 top
IC22  104,48 111.8 top
IC23  80,48 111.8 top
IC24  84,48 111.8 top
IC25  88,48 111.8 top
IC26  62,33.4 90 bottom
IC27  67,6.4 0 bottom
IC28  47,11.6 0 bottom
IC29  49,26.8 90 bottom
IC30  42.6,26.8 270 bottom
J1  62,0 180 bottom
J2  52,0 180 bottom
J3  71.8,29 270 bottom
L1  42.2,14.2 90 bottom
L2  72.2,15.2 0 bottom
R1  8,50 180 bottom
R2  52,50 180 bottom
R3  8,47 180 bottom
R4  52,47 180 bottom
R5  12,50 180 bottom
R6  36,50 180 bottom
R7  12,47 180 bottom
R8  36,47 180 bottom
R9  16,50 180 bottom
R10  40,50 180 bottom
R11  16,47 180 bottom
R12  40,47 180 bottom
R13  20,50 180 bottom
R14  44,50 180 bottom
R15  20,47 180 bottom
R16  44,47 180 bottom
R17  24,50 180 bottom
R18  48,50 180 bottom
R19  24,47 180 bottom
R20  48,47 180 bottom
R21  28,50 180 bottom
R22  56,50 180 bottom
R23  28,47 180 bottom
R24  56,47 180 bottom
R25  32,50 180 bottom
R26  60,50 180 bottom
R27  32,47 180 bottom
R28  60,47 180 bottom
R29  64,50 180 bottom
R30  92,50 180 bottom
R31  64,47 180 bottom
R32  92,47 180 bottom
R33  68,50 180 bottom
R34  96,50 180 bottom
R35  68,47 180 bottom
R36  96,47 180 bottom
R37  72,50 180 bottom
R38  100,50 180 bottom
R39  72,47 180 bottom
R40  100,47 180 bottom
R41  76,50 180 bottom
R42  104,50 180 bottom
R43  76,47 180 bottom
R44  104,47 180 bottom
R45  80,50 180 bottom
R46  80,47 180 bottom
R47  84,50 180 bottom
R48  84,47 180 bottom
R49  88,50 180 bottom
R50  88,47 180 bottom
R51  60.1,28.7 90 top
R52  67.2,2.8 0 bottom
R53  44.8,14.2 90 bottom
R54  66,13.2 0 bottom
R55  43.2,10 0 bottom
R56  46.2,9.2 0 bottom
R57  55.8,21.6 270 bottom  (not fitted)
R58  55.8,21.6 270 top  (not fitted)
R59  59,21.6 270 top
R60  57.4,21.6 270 bottom  (not fitted)
R61  57.4,21.6 270 top  (not fitted)
R62  60.6,21.6 270 bottom
R63  62.2,21.6 90 bottom
R64  59,21.6 90 bottom  (not fitted)
R65  63.8,21.6 90 bottom

### Tracks (layer width: path | path; a pad name or v marks a point on that pad's centre or on a via)
!RST  (via drill 0.35)
  Top 0.3: v55.6,33.8 C6.1 | v71.2,32.8 68.6,35.4 v58.4,35.4
  Bottom 0.3: IC26.14 55.5,33.9 v55.6,33.8 56.8,33.8 v58.4,35.4 | v71.2,32.8 71.25,32.75 J3.1
BOOT0  (via drill 0.35)
  Top 0.3: v58.8,27.2 59.55,27.95 R51.P$1
  Bottom 0.3: IC26.94 59,27 v58.8,27.2
GND  (via drill 0.35)
  Top 0.3: v56.2,39.8 56.05,39.65 C4.2 | v66.6,39.8 66.45,39.65 C1.2 | v55.6,30.8 56.55,30.8 C5.2 | v68.4,28.2 68.25,28.35 C2.2 | v55.6,36.2 55.75,36.05 C20.2 | v56.8,27 57.15,27.35 C3.2
  Bottom 0.25: R52.P$2 65.75,2.1 J1.G2 | 66.8,7.4 67,7.2 IC27.11 | IC27.3 71,6.4
  Bottom 0.3: IC26.27 56.5,40.1 v56.2,39.8 | IC26.49 67.5,40.3 67,39.8 v66.6,39.8 | IC26.10 55.1,31.9 55.6,31.4 v55.6,30.8 | IC26.74 68.7,27.9 v68.4,28.2 | IC26.19 55.4,36.4 v55.6,36.2 | IC26.20 51.9,36.9 51.45,36.45 C19.2 | IC29.4 47.09,22.9 v46.8,22.6 | C15.2 45.35,21.15 v45.2,21 | C18.2 44.75,32.45 v44.6,32.6 | IC30.4 44.67,28.88 v44.8,29 | C16.2 52.6,22.2 v52.8,22.4 | v52.8,20.8 C14.2 | IC26.99 56.5,26.7 v56.8,27 | C12.2 v70.6,20.4 | IC27.10 66.8,7.4
  Bottom 0.6: v52.6,30 52.6,30.95 C17.NEG 51,32.55 C19.2 | v63.4,1.4 64.4,1.4 64.42,1.43 J1.G2 | v60.6,1.4 59.8,1.4 59.6,1.2 59.58,1.23 J1.G1 | v62,3.8 62.62,4.43 J1.2 62.62,4.38 v63.2,3.8 | J2.1 v49.5,4 | v55.3,1.4 56.1,1.4 56.2,1.3 56.3,1.4 J2.G2 | v48.7,1.4 47.8,1.4 47.7,1.5 J2.G1 | v75.6,24.6 75.6,22.8 J3.G2 | v75.6,33.4 75.6,35.2 J3.G1 | v74.4,25.2 72.65,25.2 J3.7
  other vias: 44.8,27.2 44.8,26.4 40.8,27.2 40.8,26.4 47.8,7.8 47,7.8 46.8,14.8 50.2,17 50.2,14.8 48.2,17 48.2,14.8 64.8,9.4
  pour Top (isolate 0.3): 111.8,59.8 111.8,36.2 77.4,36.2 77.4,18.4 68.8,18.4 68.8,12 77.4,12 77.4,0.2 40.2,0.2 40.2,12.4 44,12.4 44,16 40.2,16 40.2,36.2 5.8,36.2 5.8,42.4 0.2,42.4 0.2,59.8
  pour Bottom (isolate 0.25, no thermals): 46.4,17.4 46.4,10.8 46.6,10.8 46.6,7 48.2,7 48.2,13 50.8,13 50.8,17.4
  pour Bottom (no thermals): 45.4,27.6 45.4,26 40.2,26 40.2,27.6
  pour Bottom (isolate 0.25, no thermals): 67.6,7.6 67.6,9.6 67.2,10 67.2,11.6 64.4,11.6 64.4,8.6 65.4,7.6
  pour Bottom (no thermals): 67.6,5.4 66.4,5.4 66.4,5 64.8,3.4 64.8,0.2 71.8,0.2 71.8,6.2 71.8,6.4 70.6,6.4 70.6,3.4 68.8,1.6 68.4,1.6 66.6,1.6 66.6,3.4 67.6,4.4
I2C1_SCL
  Bottom 0.3: IC26.92 60,24.4 59.4,23.8 58,23.8 57.4,23.2 R60.P$1
I2C1_SDA
  Bottom 0.3: IC26.93 59.5,24.7 59.2,24.4 56.6,24.4 55.8,23.6 R57.P$1
I2C1_SMBA
  Bottom 0.3: IC26.91 60.5,24.1 59,22.6 R64.P$2
IC27_SW  (via drill 0.35)
  Top 0.3: v74.8,12.4 71.4,9 v68.4,9
  Bottom 0.25: v68.4,9 IC27.1
  Bottom 0.3: L2.1 75.05,12.65 v74.8,12.4
IC28_SW
  Bottom 0.25: IC28.7 43.6,11.85
  Bottom 0.3: 43.6,11.85 43.6,12.2
  pour Bottom (no thermals): 43.8,13.6 40.2,13.6 40.2,11.2 43.8,11.2
N$1  (via drill 0.35)
  Top 0.3: v10.2,51 11.01,50.19 IC3.4
  Bottom 0.3: R5.P$1 10.25,51 v10.2,51
N$2  (via drill 0.35)
  Top 0.3: v6.2,51 7.01,50.19 IC1.4
  Bottom 0.3: R1.P$1 6.25,51 v6.2,51
N$3  (via drill 0.35)
  Top 0.3: v14.2,51 15.01,50.19 IC5.4
  Bottom 0.3: R9.P$1 14.25,51 v14.2,51
N$4  (via drill 0.35)
  Top 0.3: v18.2,51 19.01,50.19 IC7.4
  Bottom 0.3: R13.P$1 18.25,51 v18.2,51
N$5  (via drill 0.35)
  Top 0.3: v22.2,51 23.01,50.19 IC9.4
  Bottom 0.3: R17.P$1 22.25,51 v22.2,51
N$6  (via drill 0.35)
  Top 0.3: v26.2,51 27.01,50.19 IC11.4
  Bottom 0.3: R21.P$1 26.25,51 v26.2,51
N$7  (via drill 0.35)
  Top 0.3: v30.2,51 31.01,50.19 IC13.4
  Bottom 0.3: R25.P$1 30.25,51 v30.2,51
N$8  (via drill 0.35)
  Top 0.3: v34.2,51 35.01,50.19 IC4.4
  Bottom 0.3: R6.P$1 34.25,51 v34.2,51
N$9  (via drill 0.35)
  Top 0.3: v38.2,51 39.01,50.19 IC6.4
  Bottom 0.3: R10.P$1 38.25,51 v38.2,51
N$10  (via drill 0.35)
  Top 0.3: v42.2,51 43.01,50.19 IC8.4
  Bottom 0.3: R14.P$1 42.25,51 v42.2,51
N$11  (via drill 0.35)
  Top 0.3: v46.2,51 47.01,50.19 IC10.4
  Bottom 0.3: R18.P$1 46.25,51 v46.2,51
N$12  (via drill 0.35)
  Top 0.3: v50.2,51 51.01,50.19 IC2.4
  Bottom 0.3: R2.P$1 50.25,51 v50.2,51
N$13  (via drill 0.35)
  Top 0.3: v54.2,51 55.01,50.19 IC12.4
  Bottom 0.3: R22.P$1 54.25,51 v54.2,51
N$14  (via drill 0.35)
  Top 0.3: v58.2,51 59.01,50.19 IC14.4
  Bottom 0.3: R26.P$1 58.25,51 v58.2,51
N$15  (via drill 0.35)
  Top 0.3: v62.2,51 63.01,50.19 IC15.4
  Bottom 0.3: R29.P$1 62.25,51 v62.2,51
N$16  (via drill 0.35)
  Top 0.3: v66.2,51 67.01,50.19 IC17.4
  Bottom 0.3: R33.P$1 66.25,51 v66.2,51
N$17  (via drill 0.35)
  Top 0.3: v70.2,51 71.01,50.19 IC19.4
  Bottom 0.3: R37.P$1 70.25,51 v70.2,51
N$18  (via drill 0.35)
  Top 0.3: v74.2,51 75.01,50.19 IC21.4
  Bottom 0.3: R41.P$1 74.25,51 v74.2,51
N$19  (via drill 0.35)
  Top 0.3: v78.2,51 79.01,50.19 IC23.4
  Bottom 0.3: R45.P$1 78.25,51 v78.2,51
N$20  (via drill 0.35)
  Top 0.3: v82.2,51 83.01,50.19 IC24.4
  Bottom 0.3: R47.P$1 82.25,51 v82.2,51
N$21  (via drill 0.35)
  Top 0.3: v86.2,51 87.01,50.19 IC25.4
  Bottom 0.3: R49.P$1 86.25,51 v86.2,51
N$22  (via drill 0.35)
  Top 0.3: v90.2,51 91.01,50.19 IC16.4
  Bottom 0.3: R30.P$1 90.25,51 v90.2,51
N$23  (via drill 0.35)
  Top 0.3: v94.2,51 95.01,50.19 IC18.4
  Bottom 0.3: R34.P$1 94.25,51 v94.2,51
N$24  (via drill 0.35)
  Top 0.3: v98.2,51 99.01,50.19 IC20.4
  Bottom 0.3: R38.P$1 98.25,51 v98.2,51
N$25  (via drill 0.35)
  Top 0.3: v102.2,51 103.01,50.19 IC22.4
  Bottom 0.3: R42.P$1 102.25,51 v102.2,51
N$26  (via drill 0.35)
  Top 0.3: v54,12 v54,8 | v54.67,19.73 R57.P$2 55.8,21.4 56,21.6 59,21.6 R59.P$2
  Bottom 0.3: J2.2 50.75,7.95 50.8,8 v54,8 | v54,12 54,19.05 v54.67,19.73 R57.P$2
N$27  (via drill 0.35)
  Top 0.3: v54.8,12 v54.8,8 | R60.P$2 v56.17,19.62 56.2,19.6 60.2,19.6 v60.4,19.8
  Bottom 0.3: J2.3 52,6.8 52.4,7.2 54.6,7.2 54.8,7.4 v54.8,8 | v54.8,12 54.8,18.25 v56.17,19.62 R60.P$2 | R62.P$2 60.6,20 v60.4,19.8
N$28  (via drill 0.35)
  Top 0.3: v53.2,4 55.4,4 55.6,4.2 v55.6,12
  Bottom 0.3: J2.4 53.25,4.05 v53.2,4 | R64.P$1 57.15,19 | v55.6,12 55.6,17.45 56.97,18.83 57.15,19 | 57.15,19 61.2,19 62.2,20 R63.P$1
N$29  (via drill 0.35)
  Top 0.3: v56.4,8 v56.4,12
  Bottom 0.3: J2.5 56.4,7.35 v56.4,8 | R65.P$1 63.8,20.2 61.6,18 57.6,18 56.4,16.8 v56.4,12
N$33
  Bottom 0.25: R52.P$1 68.4,3.25 IC27.5
N$34
  Bottom 0.25: IC27.4 69.4,5.9 69.4,4.05 C10.1
N$36
  Bottom 0.3: R54.P$2 63.4,13.2 62.8,12.6 62.8,11.05 C11.1
N$38
  Bottom 0.25: IC28.8 45.25,12.35 44.8,12.8 R53.P$1
N$39
  Bottom 0.25: IC28.5 45.45,10.25 R56.P$2
  Bottom 0.3: R56.P$2 44.6,9.2 43.95,9.85 R55.P$1
SENSOR_1  (via drill 0.35)
  Top 0.3: v52.8,34.2 52.46,34.2 52.45,34.19 51.95,34.19 51.94,34.2 51.4,34.2 42.8,42.8 11.6,42.8 8,46.4 8.01,46.41 IC1.1 8.01,46.21 v7.6,45.8
  Bottom 0.3: IC26.15 53,34.4 v52.8,34.2 | R3.P$1 7.25,46.15 v7.6,45.8
SENSOR_2  (via drill 0.35)
  Top 0.3: v52.2,34.8 51.8,34.8 43.2,43.4 15,43.4 12,46.4 | 12,46.4 IC3.1 | v11.6,45.8 12,46.2 12,46.4
  Bottom 0.3: IC26.16 52.3,34.9 v52.2,34.8 | R7.P$1 11.25,46.15 v11.6,45.8
SENSOR_3  (via drill 0.35)
  Top 0.3: v52.2,35.6 43.8,44 18.4,44 16,46.4 16.01,46.41 IC5.1 16.01,46.21 v15.6,45.8
  Bottom 0.3: IC26.17 52.4,35.4 v52.2,35.6 | R11.P$1 15.25,46.15 v15.6,45.8
SENSOR_4  (via drill 0.35)
  Top 0.3: v52.8,36.2 44.4,44.6 22,44.6 20.2,46.4 20.01,46.59 IC7.1 20.01,46.21 v19.6,45.8
  Bottom 0.3: IC26.18 53.1,35.9 v52.8,36.2 | R15.P$1 19.25,46.15 v19.6,45.8
SENSOR_5  (via drill 0.35)
  Top 0.3: IC9.1 24.6,46.71 v24.6,46
  Bottom 0.3: IC26.23 52.4,38.4 52.4,41.4 52.2,41.6 27.8,41.6 23.4,46 | R19.P$1 23.25,46.15 23.3,46.1 23.4,46 | v24.6,46 23.4,46
SENSOR_6  (via drill 0.35)
  Top 0.3: IC11.1 28.6,46.71 v28.6,46
  Bottom 0.3: IC26.24 53,38.9 53,42 52.8,42.2 31.2,42.2 27.4,46 | R23.P$1 27.25,46.15 27.4,46 | v28.6,46 27.4,46
SENSOR_7  (via drill 0.35)
  Top 0.3: IC13.1 32.6,46.71 v32.6,46
  Bottom 0.3: IC26.25 54.25,42.55 54,42.8 34.6,42.8 31.4,46 | R27.P$1 31.25,46.15 31.4,46 | v32.6,46 31.4,46
SENSOR_8  (via drill 0.35)
  Top 0.3: IC4.1 36.6,46.71 v36.6,46
  Bottom 0.3: IC26.26 56,42.8 54.8,42.8 54.2,43.4 38,43.4 35.4,46 | R8.P$1 35.25,46.15 35.4,46 | v36.6,46 35.4,46
SENSOR_9  (via drill 0.35)
  Top 0.3: IC6.1 40.6,46.71 v40.6,46
  Bottom 0.3: IC26.29 57.5,43.3 57.4,43.4 55,43.4 54.4,44 41.4,44 39.4,46 | R12.P$1 39.25,46.15 39.4,46 | v40.6,46 39.4,46
SENSOR_10  (via drill 0.35)
  Top 0.3: IC8.1 44.6,46.71 v44.6,46
  Bottom 0.3: IC26.30 58,43.8 57.8,44 55.2,44 54.6,44.6 44.8,44.6 43.4,46 | R16.P$1 43.25,46.15 43.4,46 | v44.6,46 43.4,46
SENSOR_11  (via drill 0.35)
  Top 0.3: IC10.1 48.6,46.71 v48.6,46
  Bottom 0.3: IC26.31 58.5,44.1 58,44.6 55.4,44.6 54.8,45.2 48.2,45.2 47.4,46 | R20.P$1 47.25,46.15 47.4,46 | v48.6,46 47.4,46
SENSOR_12  (via drill 0.35)
  Top 0.3: IC2.1 52.4,46.91 v52.4,45.8
  Bottom 0.3: IC26.32 59,44.6 58.4,45.2 55.6,45.2 55,45.8 v52.4,45.8 51.8,45.8 51.25,46.35 R4.P$1
SENSOR_13  (via drill 0.35)
  Top 0.3: IC12.1 56.4,46.91 v56.4,45.8
  Bottom 0.3: IC26.33 59.5,44.9 58.6,45.8 v56.4,45.8 55.8,45.8 55.25,46.35 R24.P$1
SENSOR_14  (via drill 0.35)
  Top 0.3: IC14.1 60.6,46.71 v60.6,46
  Bottom 0.3: IC26.34 60,45.6 59.6,46 | R28.P$1 59.25,46.35 59.6,46 | v60.6,46 59.6,46
SENSOR_15  (via drill 0.35)
  Top 0.3: IC15.1 63.71,47 62.6,47 v62.2,46.6
  Bottom 0.3: R31.P$1 62.6,47 v62.2,46.6 60.5,44.9 IC26.35
SENSOR_16  (via drill 0.35)
  Top 0.3: IC17.1 68.4,46.91 v68.4,46
  Bottom 0.3: IC26.36 61,44 62.8,45.8 66.05,45.8 R35.P$1 67.25,46.55 67.8,46 v68.4,46
SENSOR_17  (via drill 0.35)
  Top 0.3: IC19.1 72.4,46.91 v72.4,46
  Bottom 0.3: IC26.37 61.5,43.7 63,45.2 68.8,45.2 70.6,47 R39.P$1 71.25,46.55 71.8,46 v72.4,46
SENSOR_18  (via drill 0.35)
  Top 0.3: IC21.1 v76,46
  Bottom 0.3: IC26.38 62,43.4 63.2,44.6 72.85,44.6 R43.P$1 75.25,46.35 75.6,46 v76,46
SENSOR_19  (via drill 0.35)
  Top 0.3: IC23.1 v80,46
  Bottom 0.3: IC26.39 62.5,43.1 63.4,44 76.25,44 R46.P$1 79.25,46.35 79.6,46 v80,46
SENSOR_20  (via drill 0.35)
  Top 0.3: IC24.1 v84,46
  Bottom 0.3: IC26.40 63,42.8 63.6,43.4 79.65,43.4 R48.P$1 83.25,46.35 83.6,46 v84,46
SENSOR_21  (via drill 0.35)
  Top 0.3: IC25.1 v88.01,46.01 v88,46
  Bottom 0.3: IC26.41 63.5,42.5 63.8,42.8 83.05,42.8 R50.P$1 87.25,46.35 87.6,46 v88,46
SENSOR_22  (via drill 0.35)
  Top 0.3: IC16.1 v92,46
  Bottom 0.3: IC26.51 70.8,39.4 73.6,42.2 86.45,42.2 R32.P$1 91.25,46.35 91.6,46 v92,46
SENSOR_23  (via drill 0.35)
  Top 0.3: IC18.1 v96,46
  Bottom 0.3: IC26.52 71.1,38.9 73.8,41.6 89.85,41.6 R36.P$1 95.25,46.35 95.6,46 v96,46
SENSOR_24  (via drill 0.35)
  Top 0.3: IC20.1 v100,46
  Bottom 0.3: IC26.53 71.4,38.4 74,41 93.25,41 R40.P$1 99.25,46.35 99.6,46 v100,46
SENSOR_25  (via drill 0.35)
  Top 0.3: IC22.1 v104,46
  Bottom 0.3: IC26.54 71.7,37.9 74.2,40.4 96.65,40.4 R44.P$1 103.25,46.35 103.6,46 v104,46
SPI3_MISO
  Bottom 0.3: IC26.79 66.5,24.3 66,23.8 62,23.8 60.6,22.4 R62.P$1
SPI3_MOSI  (via drill 0.35)
  Top 0.3: v66,27.2 61.15,22.35 R59.P$1
  Bottom 0.3: IC26.80 v66,27.2
SPI3_NSS
  Bottom 0.3: IC26.77 67.5,23.1 66.75,22.35 R65.P$2
SPI3_SCK
  Bottom 0.3: IC26.78 67,23.8 66.4,23.2 62.6,23.2 62.2,22.8 R63.P$2
STLINK_SWO  (via drill 0.35)
  Top 0.3: v71.2,27.8 68.6,30.4 66,30.4 63.8,28.2 62,28.2 v61.6,27.8
  Bottom 0.3: IC26.89 61.5,27.7 v61.6,27.8 | v71.2,27.8 72.55,27.8 J3.5
STLINK_TCK  (via drill 0.35)
  Top 0.3: v71.2,26.4 69.2,24.4 v68.2,24.4
  Bottom 0.3: IC26.76 68,24.6 v68.2,24.4 | J3.6 71.3,26.5 v71.2,26.4
STLINK_TMS
  Bottom 0.3: IC26.72 72.5,28.9 J3.4
STLINK_USART1_RX
  Bottom 0.3: IC26.69 70.8,30.4 71,30.2 72.55,30.2 J3.3
STLINK_USART1_TX
  Bottom 0.3: IC26.68 70.7,30.9 71.3,31.5 J3.2
USART2_RX  (via drill 0.35)
  Top 0.3: v62.4,27.2 59.2,24 56.8,24 55.8,23 R58.P$1
  Bottom 0.3: IC26.87 62.5,27.1 v62.4,27.2
USART2_TX  (via drill 0.35)
  Top 0.3: v63.2,27.2 63,27 63,26.95 59.45,23.4 58,23.4 57.4,22.8 R61.P$1
  Bottom 0.3: IC26.86 63,26.95 63,27 v63.2,27.2
VBAT  (via drill 0.35)
  Top 0.3: v70.4,8.2 64.8,8.2 v61.4,8.2 | v70.4,7.4 v61.4,7.4
  Bottom 0.25: IC28.3 49.6,11.35 | 49.6,11.35 49.9,11.35 C8.1 | IC28.2 49.1,11.85 49.6,11.35 | IC27.2 69.9,6.9 v70.4,7.4 | IC27.7 64.1,5.9 62.6,7.4 v61.4,7.4
  Bottom 0.6: J1.1 61.38,7.02 61,7.4
  pour Bottom (no thermals): 53.2,11.8 49.2,11.8 49.2,8.8 53.2,8.8
  pour Bottom: 48,25.4 48,18.4 51.8,18.4 51.8,11.8 50.6,11.8 50.6,10.4 53.2,10.4 53.2,19.6 50,19.6 50,25.4
  pour Bottom (no thermals): 71.8,11.6 69.6,11.6 69.6,7 71.8,7
  pour Bottom: 62,9.2 62,6.8 60.2,6.8 58.2,8.8 52.8,8.8 52.8,11.2 60,11.2
VDD  (via drill 0.35)
  Top 0.3: v57.4,39.8 57.55,39.65 C4.1 | v68,39.8 68,38.85 C1.1 | v55.6,32.4 55.65,32.35 C5.1 | v55.6,29.4 C7.1 | v68.4,27 68.25,26.85 C2.1 | C3.1 55.65,27.15 v55.7,27.1 | v62.8,9.6 62.8,13.2 v67.8,13.2
  Bottom 0.25: IC27.8 64.8,6.4
  Bottom 0.3: IC26.28 57,40.2 v57.4,39.8 | IC26.50 v68,39.8 | IC26.11 v55.6,32.4 | IC26.6 55.1,29.9 v55.6,29.4 | IC26.75 68.8,27.4 v68.4,27 | v62.8,9.6 62.8,8.4 64.8,6.4 | IC26.100 56,26.8 v55.7,27.1 | C12.1 69.2,23.65 | R54.P$1 v67.8,13.2 68.4,13.2 69.35,14.15 L2.2
  Bottom 0.6: L2.2 69.2,15.35 69.2,23.65 69.2,26.2 v68.4,27 63,32.4 | v57.4,39.8 57.4,38 62.2,33.2 | 63,32.4 62.4,33 | 62.4,33 62.2,33.2 | v55.6,32.4 63,32.4 | v68,39.8 68,38.8 62.4,33.2 62.2,33.2 | v55.7,27.1 55.7,29.3 v55.6,29.4 58.8,29.4 62.4,33
  pour Bottom: 60.8,36.6 66,36.6 66,29.6 65.6,29.2 59,29.2 58.6,29.6 58.6,34.4
VDDA  (via drill 0.35)
  Top 0.3: v55.6,37.6 55.65,37.55 C20.1
  Bottom 0.3: v55.6,37.6 55.3,37.9 IC26.22 52.1,37.9 51.8,38.2 51.8,39.6 51.4,40 51,40 | R3.P$2 R1.P$2 8.8,50.05 8.8,52.4 | R7.P$2 R5.P$2 12.8,50.05 12.8,52.4 | R11.P$2 R9.P$2 16.75,52.35 16.8,52.4 | R15.P$2 R13.P$2 20.8,50.05 20.8,52.4 | R19.P$2 R17.P$2 24.75,52.35 24.8,52.4 | R23.P$2 R21.P$2 28.75,52.35 28.8,52.4 | R27.P$2 R25.P$2 32.8,50.05 32.8,52.4 | R8.P$2 R6.P$2 36.75,52.35 36.8,52.4 | R12.P$2 R10.P$2 40.75,52.25 40.6,52.4 | R16.P$2 R14.P$2 44.75,52.25 44.6,52.4 | R20.P$2 R18.P$2 48.75,52.25 48.6,52.4 | R4.P$2 R2.P$2 52.75,52.35 52.8,52.4 | R24.P$2 R22.P$2 56.75,52.25 56.6,52.4 | R28.P$2 R26.P$2 60.75,52.25 60.6,52.4 | R31.P$2 R29.P$2 64.75,52.35 64.8,52.4 | R35.P$2 R33.P$2 68.75,52.25 68.6,52.4 | R39.P$2 R37.P$2 72.75,52.35 72.8,52.4 | R43.P$2 R41.P$2 76.75,52.25 76.6,52.4 | R46.P$2 R45.P$2 80.75,52.35 80.8,52.4 | R48.P$2 R47.P$2 84.75,52.25 84.6,52.4 | R50.P$2 R49.P$2 88.75,52.35 88.8,52.4 | R32.P$2 R30.P$2 92.75,52.25 92.6,52.4 | R36.P$2 R34.P$2 96.75,52.35 96.8,52.4 | R40.P$2 R38.P$2 100.8,50.05 100.8,52.4 | R44.P$2 R42.P$2 104.75,52.25 104.6,52.4
  pour Bottom: 43,41 51.8,41 51.8,39.6 43,39.6
  pour Bottom: 43,28.6 40.2,28.6 40.2,36.2 0.2,36.2 0.2,59.8 105,59.8 105,52.2 5,52.2 5,46.4 10.4,41 43,41
VDDA3.5  (via drill 0.35)
  Top 0.3: v41.4,10 44,10 v45,11 45,14.8 v43.4,16.4
  Bottom 0.25: IC28.6 45.35,11.35 v45,11 | R55.P$2 v41.4,10
  pour Bottom (isolate 0.25): 43.6,25 43.6,17.2 40.2,17.2 40.2,25
  pour Bottom (no thermals): 45.2,14.8 40.2,14.8 40.2,17.4 45.2,17.4
VREF3.3
  Bottom 0.3: IC26.21 51.8,37.4 51.25,37.95 C19.1
  Bottom 0.72: IC29.6 48.36,31.69 C17.POS 47.85,36.45 49.35,37.95 C19.1

### Text on the board
tNames: S1 | S25 | REV 2.0 2018-11-26